# Altium schematic sheet 1_Power.SchDoc
size A3; DocumentNumber: 2; SheetNumber: 2; SheetTotal: 6
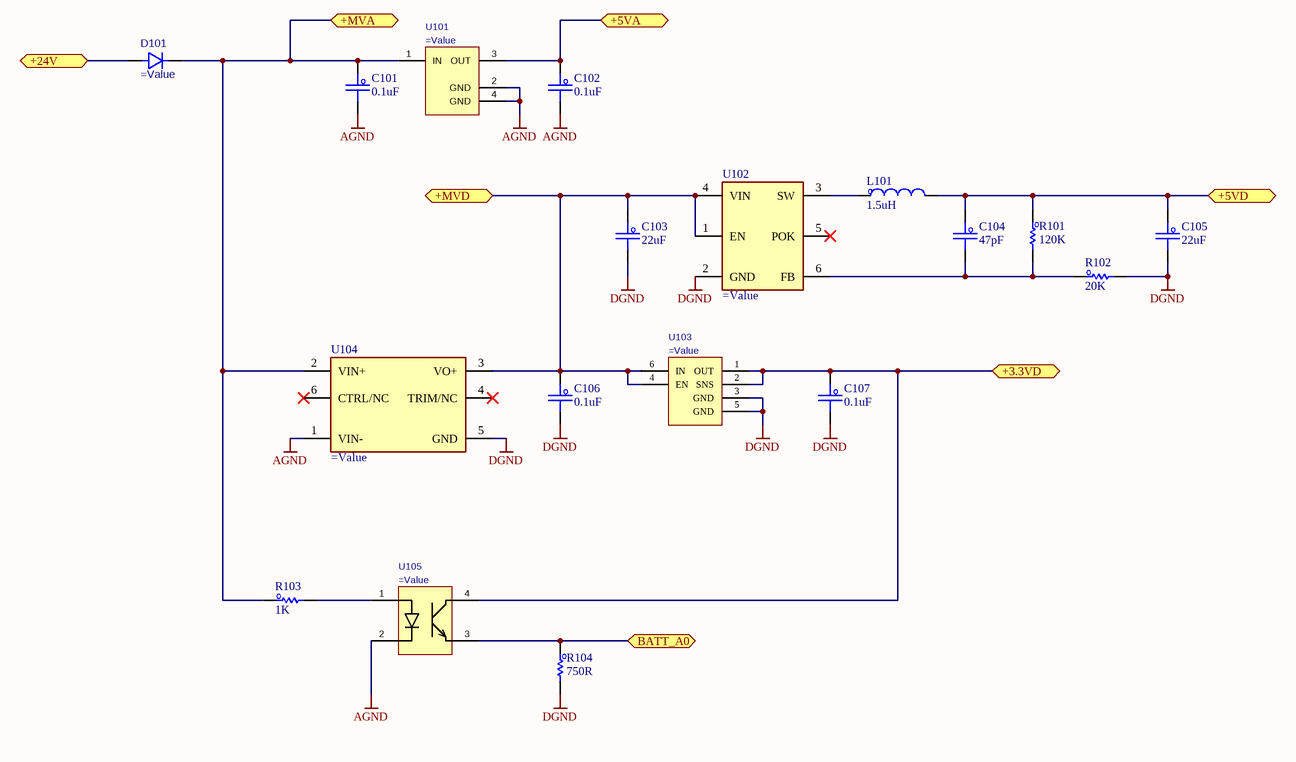
[diagram p0: 1_Power.SchDoc]

## Parts
C101  0.1uF  [C_0603]
C102  0.1uF  [C_0603]
C103  22uF  [C_0603]
C104  47pF  [C_0603]
C105  22uF  [C_0603]
C106  0.1uF  [C_0603]
C107  0.1uF  [C_0603]
D101  (no value)  [SOD323]
L101  1.5uH  [L_0603]
R101  120K  [R_0603]
R102  20K  [R_0603]
R103  1K  [R_0603]
R104  750R  [R_0603]
U101  (no value)  [SOT230P700X180-4N]
U102  (no value)  [SOT95P270X115-6M]
U103  (no value)  [SON65P200X200X80-7N]
U104  (no value)  [CONV_HLK-20D2405]
U105  (no value)  [SOIC_M618A-3T_VI]

## Ports
+3.3VD (bidir), +5VA (bidir), +5VD (bidir), +24V (bidir), +MVA (bidir), +MVD (bidir), BATT_A0 (bidir)

## Nets
AGND: C101.2 C102.2 U101.2(GND) U101.4(GND) U104.1(VIN-) U105.2(C_2)
DGND: C103.2 C105.2 C106.2 C107.2 R102.2 R104.2 U102.2(GND) U103.3(GND) U103.5(GND) U104.5(GND)
+3.3VD: C107.1 U103.1(OUT) U103.2(SNS) U105.4(C) ; port +3.3VD
+5VA: C102.1 U101.3(OUT) ; port +5VA
+5VD: C104.1 C105.1 L101.2 R101.1 ; port +5VD
+24V: D101.2 ; port +24V
+MVA: C101.1 D101.1 R103.1 U101.1(IN) U104.2(VIN+) ; port +MVA
+MVD: C103.1 C106.1 U102.1(EN) U102.4(VIN) U103.4(EN) U103.6(IN) U104.3(VO+) ; port +MVD
BATT_A0: R104.1 U105.3(E) ; port BATT_A0
NetC104_2: C104.2 R101.2 R102.1 U102.6(FB)
NetL101_1: L101.1 U102.3(SW)
NetR103_2: R103.2 U105.1(A)

Not connected (* = marked no-connect by the designer): U102 5(POK)*; U104 4(TRIM/NC)* 6(CTRL/NC)*

## Notes on the sheet
- Title :
- Revision :
- ผู้จัดทำ:
- Size:
- A3
- Time:
- ผู้เขียน:
- บริษัท ยูนิเวอร์แซล ยูทีลิตี้ส์ จำกัด (มหาชน) เลขที่ 1 อาคาร อีสท์วอเตอร์ ชั้น 18 ซอยวิภาวดีรังสิต 5 แขวงจอมพล เขตจตุจักร กรุงเทพฯ 10900
  Tel : +662-272-1688
  Fax :+662-2721690-1
- -
- Sheet:
- of
- ผู้อำนวยการ
- ผู้ตรวจสอบ:
- Number:
- กรรมการผู้จัดการ:
- File:

## Library data of the parts
C101 C102 C106 C107 = C_Capacitor: CAP CER 0.1UF 50V X7R 0603; Manufacturer: KEMET; PartNumber: C0603C104K5RACTU; PackageReference: 0603; PartID: 399-5089-1-ND; Value2: 50V; Value: 0.1uF; Value3: *
C103 C105 = C_Capacitor: CAP CER 22UF 10V X5R 0603; Manufacturer: TDK Corporation; PartNumber: C1608X5R1A226M080AC; PackageReference: 0603; PartID: 445-9077-1-ND; Value2: 10V; Value: 22uF; Value3: *
C104 = C_Capacitor: CAP CER 47PF 50V X7R 0603; Manufacturer: KEMET; PartNumber: C0603C470J5RAC7867; PackageReference: 0603; PartID: 399-C0603C470J5RAC7867CT-ND; Value2: 50V; Value: 47pF; Value3: *
D101 = D_PW_SD103AWS: DIODE SCHOTTKY 40V 2A 0603; Manufacturer: Slkor(SLKORMICRO Elec.); Value: SD103AWS; PackageReference: SOD-323; PartID: C513472; PartNumber: SD103AWS
L101 = L_Inductor: 1.5 µH Shielded Wirewound Inductor 1 A 200mOhm Max 0603 (1608 Metric); Manufacturer: Taiyo Yuden; PartNumber: MBKK1608T1R5M; Value2: 1Mhz; Value: 1.5uH; PackageReference: 0603; PartID: 587-4149-1-ND; Value3: *
R101 = R_Resister: RES 120K OHM 5% 1/10W 0603; Manufacturer: YAGEO; PartNumber: RC0603JR-07120KL; Value2: 0.1W; Value: 120K; PackageReference: 0603; PartID: 311-120KGRCT-ND; Value3: *
R102 = R_Resister: RES 20K OHM 1% 1/10W 0603; Manufacturer: YAGEO; PartNumber: RC0603FR-0720KL; Value2: 0.1W; Value: 20K; PackageReference: 0603; PartID: 311-20.0KHRCT-ND; Value3: *
R103 = R_Resister: RES SMD 1K OHM 5% 1/10W 0603; Manufacturer: Vishay Dale; PartNumber: CRCW06031K00JNEA; Value2: 0.1W; Value: 1K; PackageReference: 0603; PartID: 541-1.0KGCT-ND; Value3: *
R104 = R_Resister: RES 715 OHM 0.1% 0.15W 0603; Manufacturer: Vishay Dale; PartNumber: RCS0603750RFKEA; Value2: 0.25W; Value: 750R; PackageReference: 0603; PartID: 541-10491-1-ND; Value3: *
U101 = IC_LDO_UA78M05QDCYRG4Q1: IC REG LINEAR 5V 500MA SOT223-4; Manufacturer: Texas Instruments; PartNumber: UA78M05QDCYRG4Q1; PackageReference: SOT-223-4; PartID: 296-22950-1-ND; Value: UA78M05QDCYRG4Q1
U102 = IC_PMS_JW5222: DC DC CONVERTER 5V 5W; PartNumber: JW5222; Manufacturer: JoulWatt Tech; Value: JW5222; PartID: C371424; PackageReference: SOT-23-5; Value2: *; Value3: *
U103 = IC_LDO_TLV76733DRVR: IC REG LINEAR 3.3V 1A 6WSON; Manufacturer: Texas Instruments; PartNumber: TLV76733DRVR; PackageReference: DCY0004A; PartID: 296-TLV76733DRVRCT-ND; Value: TLV76733DRVR
U104 = IC_PMS_HLK-X0D2405: 20W DC/DC IN 9-36V OUT 5V; Manufacturer: HI-LINK; Value: HLK-10D2405; PackageReference: *; PartID: C2761163; PartNumber: HLK-10D2405
U105 = IC_OPTO_VOM618A-3T: OPTOISOLATOR 3.75KV TRANS 4-SOP; Manufacturer: Vishay; Value: VOM618A-3T; PackageReference: 4-SOP; PartID: VOM618A-3CT-ND; PartNumber: VOM618A-3T